# EAGLE schematic ATM8_mainboard (EAGLE 6.4)
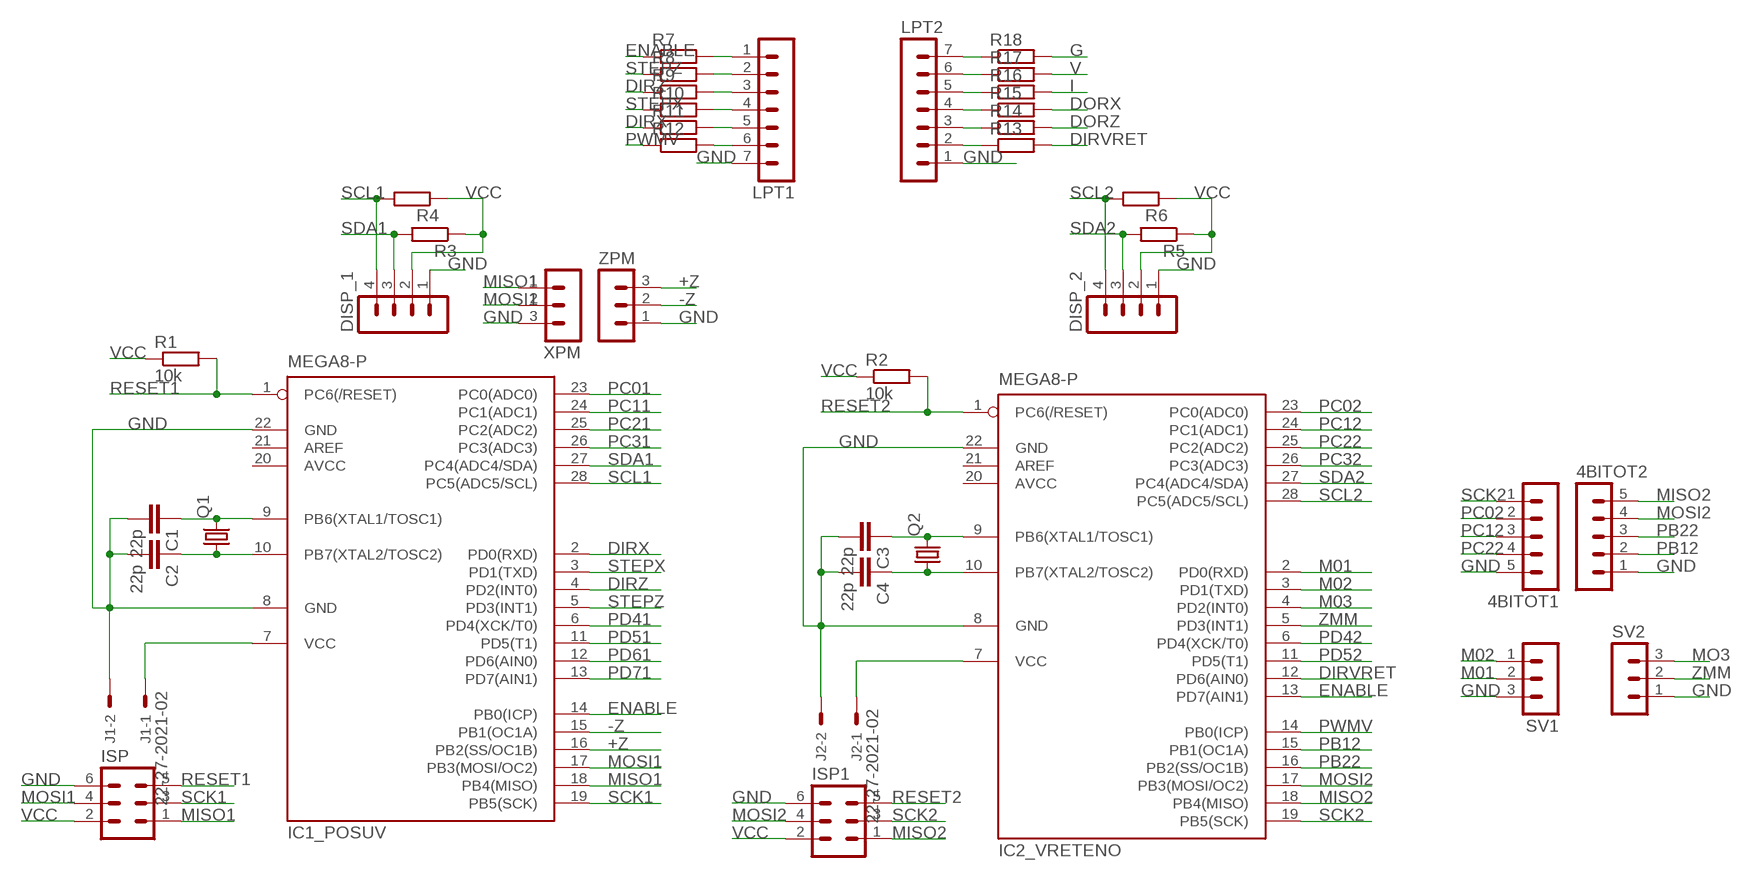
[diagram p0: schematic, sheet 1]

## Parts
4BITOT1  MA05-1  [MA05-1]
4BITOT2  MA05-1  [MA05-1]
C1  22p  C-EU025-024X044  [C025-024X044]
C2  22p  C-EU025-024X044  [C025-024X044]
C3  22p  C-EU025-024X044  [C025-024X044]
C4  22p  C-EU025-024X044  [C025-024X044]
DISP_1  MA04-1  [MA04-1]
DISP_2  MA04-1  [MA04-1]
IC1_POSUV  MEGA8-P  [DIL28-3]
IC2_VRETENO  MEGA8-P  [DIL28-3]
ISP  MA03-2  [MA03-2]
ISP1  MA03-2  [MA03-2]
J1  22-27-2021-02  [6410-02]
J2  22-27-2021-02  [6410-02]
LPT1  MA07-1  [MA07-1]
LPT2  MA07-1  [MA07-1]
Q1  CRYSTALHC49S  [HC49/S]
Q2  CRYSTALHC49S  [HC49/S]
R1  10k  R-EU_0207/7  [0207/7]
R2  10k  R-EU_0207/7  [0207/7]
R3  R-EU_0207/10  [0207/10]
R4  R-EU_0207/10  [0207/10]
R5  R-EU_0207/10  [0207/10]
R6  R-EU_0207/10  [0207/10]
R7  R-EU_0207/10  [0207/10]
R8  R-EU_0207/10  [0207/10]
R9  R-EU_0207/10  [0207/10]
R10  R-EU_0207/10  [0207/10]
R11  R-EU_0207/10  [0207/10]
R12  R-EU_0207/10  [0207/10]
R13  R-EU_0207/10  [0207/10]
R14  R-EU_0207/10  [0207/10]
R15  R-EU_0207/10  [0207/10]
R16  R-EU_0207/10  [0207/10]
R17  R-EU_0207/10  [0207/10]
R18  R-EU_0207/10  [0207/10]
SV1  MA03-1  [MA03-1]
SV2  MA03-1  [MA03-1]
XPM  MA03-1  [MA03-1]
ZPM  MA03-1  [MA03-1]

## Nets
+Z: IC1_POSUV.16(PB2(SS/OC1B)) ZPM.3
-Z: IC1_POSUV.15(PB1(OC1A)) ZPM.2
DIRVRET: IC2_VRETENO.12(PD6(AIN0)) R13.2
DIRX: IC1_POSUV.2(PD0(RXD)) R11.1
DIRZ: IC1_POSUV.4(PD2(INT0)) R9.1
DORX: R15.2
DORZ: R14.2
ENABLE: IC1_POSUV.14(PB0(ICP)) IC2_VRETENO.13(PD7(AIN1)) R7.1
G: R18.2
GND: 4BITOT1.5 4BITOT2.1 C1.2 C2.2 C3.2 C4.2 DISP_1.1 DISP_2.1 IC1_POSUV.8(GND) IC1_POSUV.22(GND) IC2_VRETENO.8(GND) IC2_VRETENO.22(GND) ISP1.6 ISP.6 J1.2 J2.2 LPT1.7 LPT2.1 SV1.3 SV2.1 XPM.3 ZPM.1
I: R16.2
M01: IC2_VRETENO.2(PD0(RXD)) SV1.2
M02: IC2_VRETENO.3(PD1(TXD)) SV1.1
M03: IC2_VRETENO.4(PD2(INT0))
MISO1: IC1_POSUV.18(PB4(MISO)) ISP.1 XPM.1
MISO2: 4BITOT2.5 IC2_VRETENO.18(PB4(MISO)) ISP1.1
MO3: SV2.3
MOSI1: IC1_POSUV.17(PB3(MOSI/OC2)) ISP.4 XPM.2
MOSI2: 4BITOT2.4 IC2_VRETENO.17(PB3(MOSI/OC2)) ISP1.4
N$1: LPT1.6 R12.2
N$2: LPT1.5 R11.2
N$3: LPT1.4 R10.2
N$4: LPT1.3 R9.2
N$5: LPT1.2 R8.2
N$6: LPT1.1 R7.2
N$7: LPT2.7 R18.1
N$8: LPT2.6 R17.1
N$9: LPT2.5 R16.1
N$10: LPT2.4 R15.1
N$11: LPT2.3 R14.1
N$12: LPT2.2 R13.1
PB3: C3.1 IC2_VRETENO.9(PB6(XTAL1/TOSC1)) Q2.2
PB4: C4.1 IC2_VRETENO.10(PB7(XTAL2/TOSC2)) Q2.1
PB6: C1.1 IC1_POSUV.9(PB6(XTAL1/TOSC1)) Q1.2
PB7: C2.1 IC1_POSUV.10(PB7(XTAL2/TOSC2)) Q1.1
PB12: 4BITOT2.2 IC2_VRETENO.15(PB1(OC1A))
PB22: 4BITOT2.3 IC2_VRETENO.16(PB2(SS/OC1B))
PC01: IC1_POSUV.23(PC0(ADC0))
PC02: 4BITOT1.2 IC2_VRETENO.23(PC0(ADC0))
PC11: IC1_POSUV.24(PC1(ADC1))
PC12: 4BITOT1.3 IC2_VRETENO.24(PC1(ADC1))
PC21: IC1_POSUV.25(PC2(ADC2))
PC22: 4BITOT1.4 IC2_VRETENO.25(PC2(ADC2))
PC31: IC1_POSUV.26(PC3(ADC3))
PC32: IC2_VRETENO.26(PC3(ADC3))
PD41: IC1_POSUV.6(PD4(XCK/T0))
PD42: IC2_VRETENO.6(PD4(XCK/T0))
PD51: IC1_POSUV.11(PD5(T1))
PD52: IC2_VRETENO.11(PD5(T1))
PD61: IC1_POSUV.12(PD6(AIN0))
PD71: IC1_POSUV.13(PD7(AIN1))
PWMV: IC2_VRETENO.14(PB0(ICP)) R12.1
RESET1: IC1_POSUV.1(PC6(/RESET)) ISP.5 R1.2
RESET2: IC2_VRETENO.1(PC6(/RESET)) ISP1.5 R2.2
SCK1: IC1_POSUV.19(PB5(SCK)) ISP.3
SCK2: 4BITOT1.1 IC2_VRETENO.19(PB5(SCK)) ISP1.3
SCL1: DISP_1.4 IC1_POSUV.28(PC5(ADC5/SCL)) R4.2
SCL2: DISP_2.4 IC2_VRETENO.28(PC5(ADC5/SCL)) R6.2
SDA1: DISP_1.3 IC1_POSUV.27(PC4(ADC4/SDA)) R3.2
SDA2: DISP_2.3 IC2_VRETENO.27(PC4(ADC4/SDA)) R5.2
STEPX: IC1_POSUV.3(PD1(TXD)) R10.1
STEPZ: IC1_POSUV.5(PD3(INT1)) R8.1
V: R17.2
VCC: DISP_1.2 DISP_2.2 IC1_POSUV.7(VCC) IC2_VRETENO.7(VCC) ISP1.2 ISP.2 J1.1 J2.1 R1.1 R2.1 R3.1 R4.1 R5.1 R6.1
ZMM: IC2_VRETENO.5(PD3(INT1)) SV2.2
Unconnected: IC1_POSUV.21(AREF) IC2_VRETENO.21(AREF)

## Power pins joined to a net without a drawn wire
AVCC: IC1_POSUV.20(AVCC) IC2_VRETENO.20(AVCC)

## Library data of the parts
4BITOT1 4BITOT2 = con-lstb:MA05-1: PIN HEADER; OC_FARNELL: unknown; OC_NEWARK: unknown
C1-C4 = resistor:C-EU: CAPACITOR, European symbol
DISP_1 DISP_2 = con-lstb:MA04-1: PIN HEADER; OC_FARNELL: unknown; OC_NEWARK: unknown
IC1_POSUV IC2_VRETENO = atmel:MEGA8-P: MICROCONTROLLER 8 Kbytes FLASH, 1 kbytes SRAM, 512 bytes EEPROM, USART, 4-channel 10 bit ADC, 2-channel 8 bit ADC Pin compatible with Atmega48, ATMega88, ATMega168 Source: avr.lbr; OC_FARNELL: unknown; OC_NEWARK: unknown
ISP ISP1 = con-lstb:MA03-2: PIN HEADER; OC_FARNELL: unknown; OC_NEWARK: unknown
J1 J2 = con-molex:22-?-02: CONNECTOR wire to board 2.54 mm (.1 inch) pitch header; OC_FARNELL: unknown; OC_NEWARK: unknown
LPT1 LPT2 = con-lstb:MA07-1: PIN HEADER; OC_FARNELL: unknown; OC_NEWARK: unknown
Q1 Q2 = crystal:CRYSTAL: CRYSTAL; OC_FARNELL: 1667008; OC_NEWARK: unknown
R1-R18 = resistor:R-EU_: RESISTOR, European symbol
SV1 SV2 XPM ZPM = con-lstb:MA03-1: PIN HEADER; OC_FARNELL: unknown; OC_NEWARK: unknown